# Altium schematic sheet flash.SchDoc
size A4; SheetNumber: 5; SheetTotal: 5
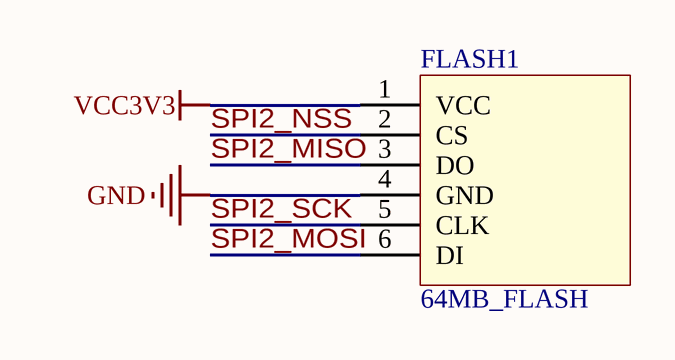
[diagram p0: flash.SchDoc]

## Parts
FLASH1  64MB_FLASH  [64MB_FLASH]

## Nets
GND: FLASH1.4(GND)
VCC3V3: FLASH1.1(VCC)
SPI2_MISO: FLASH1.3(DO)
SPI2_MOSI: FLASH1.6(DI)
SPI2_NSS: FLASH1.2(CS)
SPI2_SCK: FLASH1.5(CLK)